# EAGLE design output (EAGLE 7.6.0)
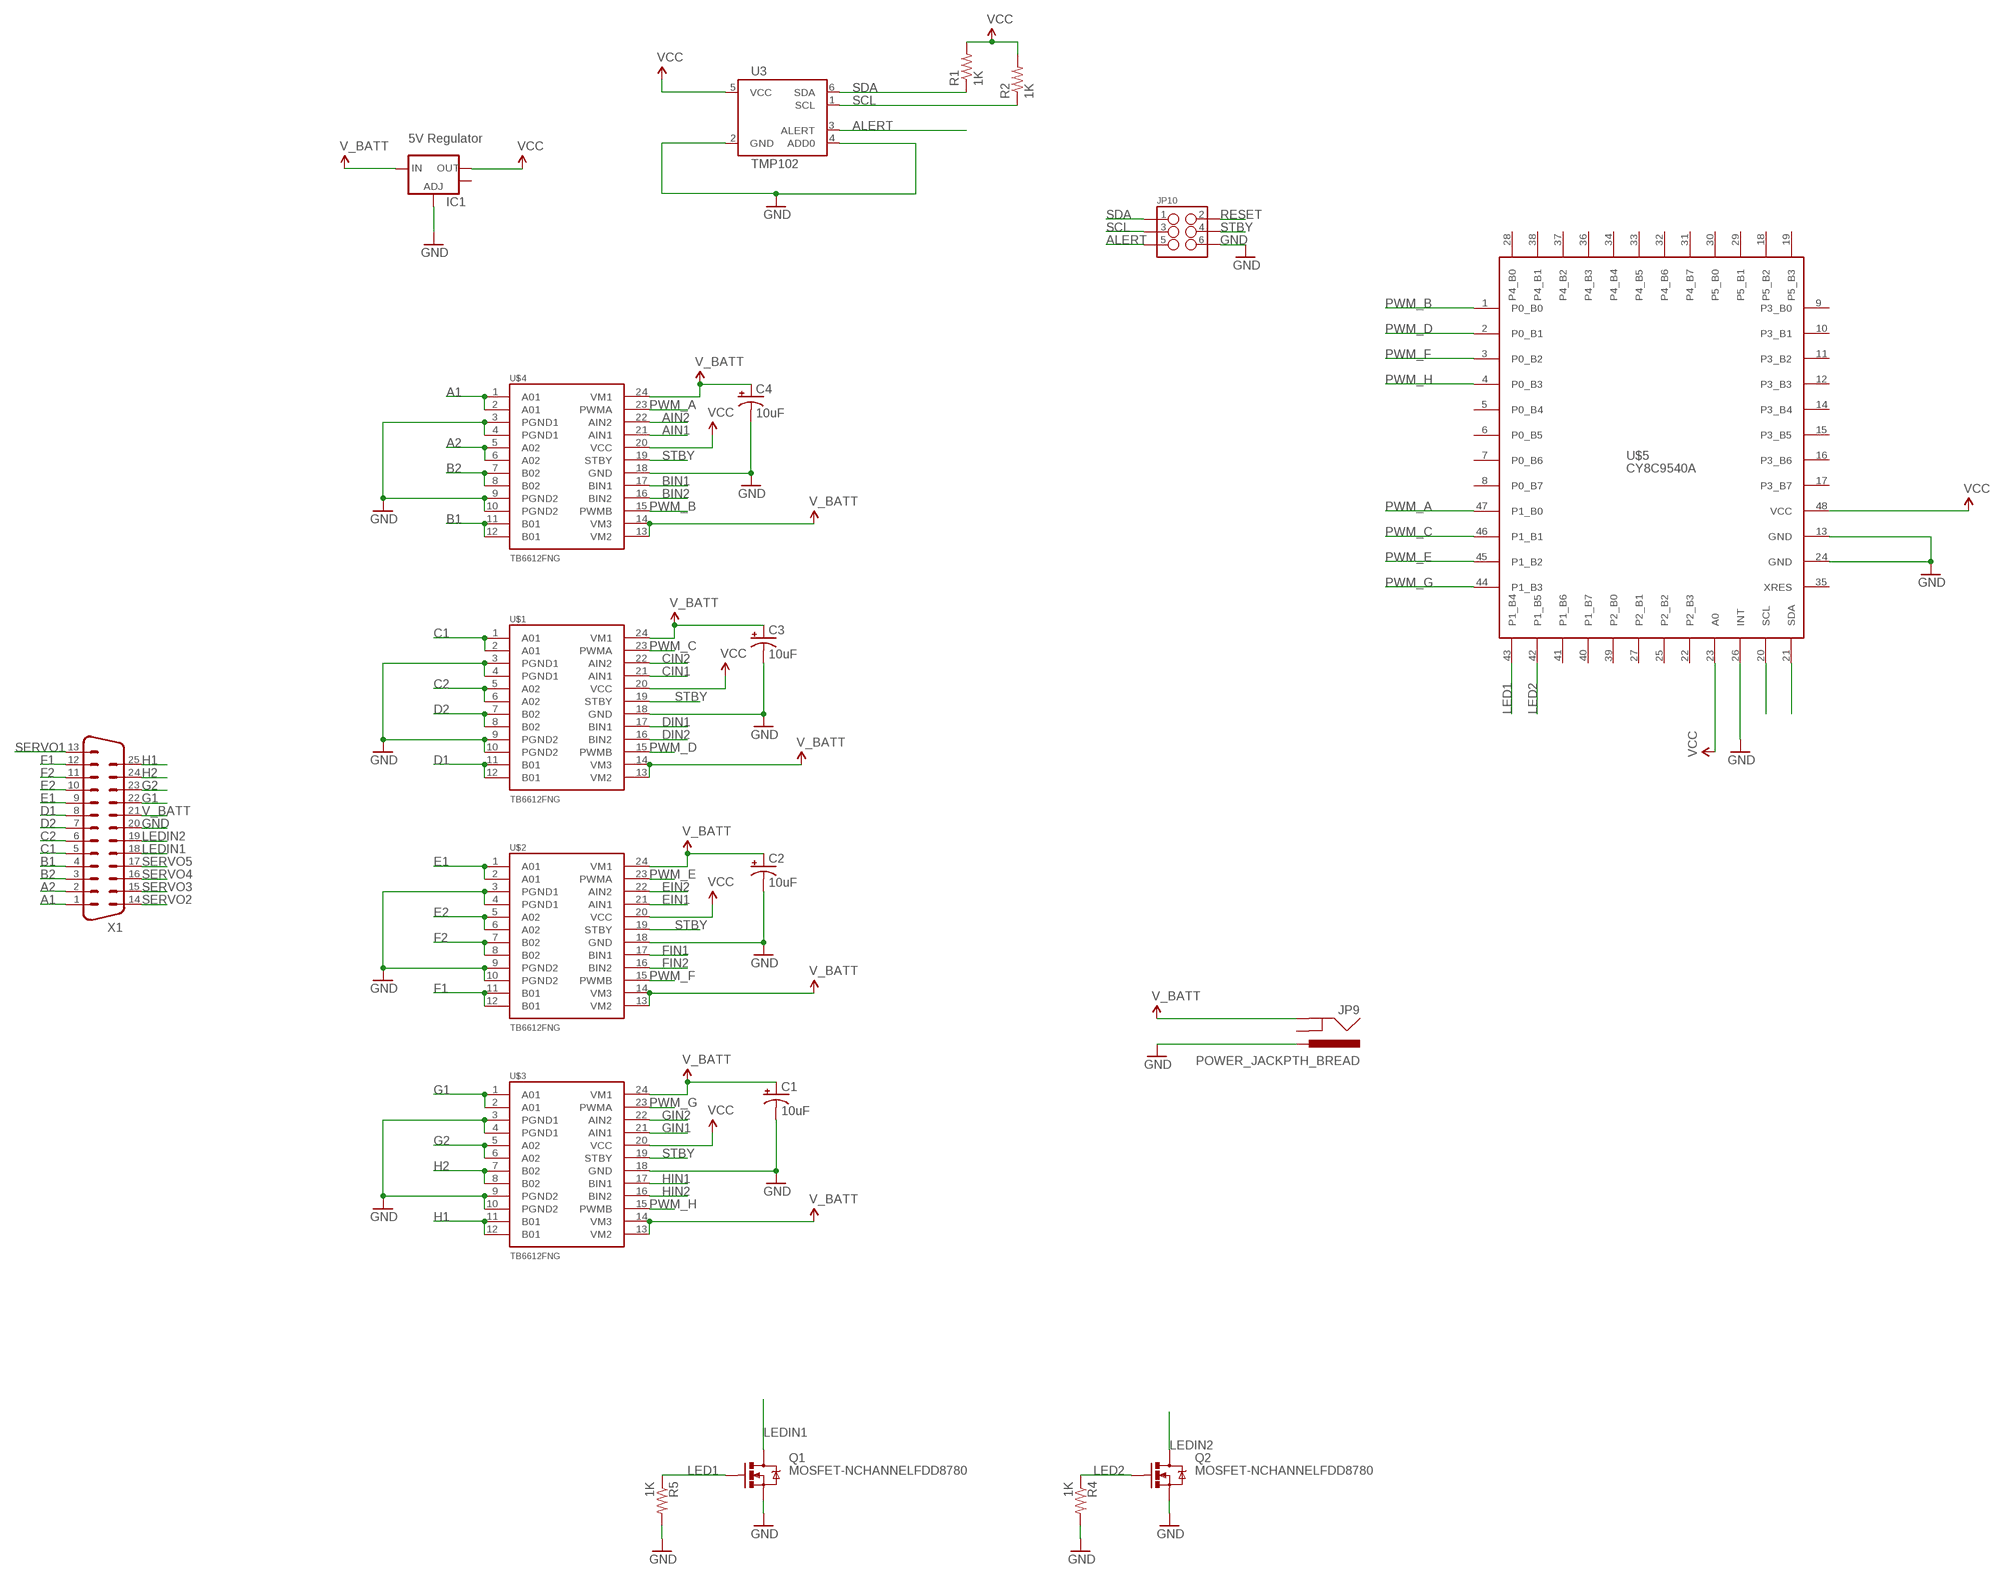
[diagram p0: schematic, sheet 1]

## Parts
C1  10uF  10UF-20V-10%(TANT)  [EIA3528]
C2  10uF  10UF-20V-10%(TANT)  [EIA3528]
C3  10uF  10UF-20V-10%(TANT)  [EIA3528]
C4  10uF  10UF-20V-10%(TANT)  [EIA3528]
IC1  V_REG_LM1117SOT223  [SOT223]
JP9  POWER_JACKPTH_BREAD  [POWER_JACK_PTH_BREAD]
JP10  M03X2SHROUD  [2X3-SHROUDED]
Q1  MOSFET-NCHANNELFDD8780  [DPAK]
Q2  MOSFET-NCHANNELFDD8780  [DPAK]
R1  1K  1KOHM-1/10W-1%(0603)  [0603-RES]
R2  1K  1KOHM-1/10W-1%(0603)  [0603-RES]
R4  1K  1KOHM-1/10W-1%(0603)  [0603-RES]
R5  1K  1KOHM-1/10W-1%(0603)  [0603-RES]
U3  TMP102  [SOT563]
U$1  TB6612FNG  [SSOP24]
U$2  TB6612FNG  [SSOP24]
U$3  TB6612FNG  [SSOP24]
U$4  TB6612FNG  [SSOP24]
U$5  CY8C9540A  [48-SSOP-CY]
X1  DB25D  [M25D]

## Nets
A1: U$4.1(A01) U$4.2(A01) X1.1
A2: U$4.5(A02) U$4.6(A02) X1.2
AIN1: U$4.21(AIN1)
AIN2: U$4.22(AIN2)
ALERT: JP10.5 U3.3(ALERT)
B1: U$4.11(B01) U$4.12(B01) X1.4
B2: U$4.7(B02) U$4.8(B02) X1.3
BIN1: U$4.17(BIN1)
BIN2: U$4.16(BIN2)
C1: U$1.1(A01) U$1.2(A01) X1.5
C2: U$1.5(A02) U$1.6(A02) X1.6
CIN1: U$1.21(AIN1)
CIN2: U$1.22(AIN2)
D1: U$1.11(B01) U$1.12(B01) X1.8
D2: U$1.7(B02) U$1.8(B02) X1.7
DIN1: U$1.17(BIN1)
DIN2: U$1.16(BIN2)
E1: U$2.1(A01) U$2.2(A01) X1.9
E2: U$2.5(A02) U$2.6(A02) X1.10
EIN1: U$2.21(AIN1)
EIN2: U$2.22(AIN2)
F1: U$2.11(B01) U$2.12(B01) X1.12
F2: U$2.7(B02) U$2.8(B02) X1.11
FIN1: U$2.17(BIN1)
FIN2: U$2.16(BIN2)
G1: U$3.1(A01) U$3.2(A01) X1.22
G2: U$3.5(A02) U$3.6(A02) X1.23
GIN1: U$3.21(AIN1)
GIN2: U$3.22(AIN2)
GND: C1.C(-) C2.C(-) C3.C(-) C4.C(-) IC1.1(ADJ) JP9.PWR JP10.6 Q1.3(S) Q2.3(S) R4.2 R5.2 U3.2(GND) U3.4(ADD0) U$1.3(PGND1) U$1.4(PGND1) U$1.9(PGND2) U$1.10(PGND2) U$1.18(GND) U$2.3(PGND1) U$2.4(PGND1) U$2.9(PGND2) U$2.10(PGND2) U$2.18(GND) U$3.3(PGND1) U$3.4(PGND1) U$3.9(PGND2) U$3.10(PGND2) U$3.18(GND) U$4.3(PGND1) U$4.4(PGND1) U$4.9(PGND2) U$4.10(PGND2) U$4.18(GND) U$5.13(GND) U$5.24(GND) U$5.26(INT) X1.20
H1: U$3.11(B01) U$3.12(B01) X1.25
H2: U$3.7(B02) U$3.8(B02) X1.24
HIN1: U$3.17(BIN1)
HIN2: U$3.16(BIN2)
LED1: Q1.1(G) R5.1 U$5.43(P1_B4)
LED2: Q2.1(G) R4.1 U$5.42(P1_B5)
LEDIN1: Q1.4(D) X1.18
LEDIN2: Q2.4(D) X1.19
PWM_A: U$4.23(PWMA) U$5.47(P1_B0)
PWM_B: U$4.15(PWMB) U$5.1(P0_B0)
PWM_C: U$1.23(PWMA) U$5.46(P1_B1)
PWM_D: U$1.15(PWMB) U$5.2(P0_B1)
PWM_E: U$2.23(PWMA) U$5.45(P1_B2)
PWM_F: U$2.15(PWMB) U$5.3(P0_B2)
PWM_G: U$3.23(PWMA) U$5.44(P1_B3)
PWM_H: U$3.15(PWMB) U$5.4(P0_B3)
RESET: JP10.2
SCL: JP10.3 R2.1 U3.1(SCL) U$5.20(SCL)
SDA: JP10.1 R1.1 U3.6(SDA) U$5.21(SDA)
SERVO1: X1.13
SERVO2: X1.14
SERVO3: X1.15
SERVO4: X1.16
SERVO5: X1.17
STBY: JP10.4 U$1.19(STBY) U$2.19(STBY) U$3.19(STBY) U$4.19(STBY)
V_BATT: C1.A(+) C2.A(+) C3.A(+) C4.A(+) IC1.3(IN) JP9.GND U$1.13(VM2) U$1.14(VM3) U$1.24(VM1) U$2.13(VM2) U$2.14(VM3) U$2.24(VM1) U$3.13(VM2) U$3.14(VM3) U$3.24(VM1) U$4.13(VM2) U$4.14(VM3) U$4.24(VM1) X1.21
VCC: IC1.2(OUT) R1.2 R2.2 U3.5(VCC) U$1.20(VCC) U$2.20(VCC) U$3.20(VCC) U$4.20(VCC) U$5.23(A0) U$5.48(VCC)
Unconnected: IC1.4(OUT) JP9.GNDBREAK U$5.5(P0_B4) U$5.6(P0_B5) U$5.7(P0_B6) U$5.8(P0_B7) U$5.9(P3_B0) U$5.10(P3_B1) U$5.11(P3_B2) U$5.12(P3_B3) U$5.14(P3_B4) U$5.15(P3_B5) U$5.16(P3_B6) U$5.17(P3_B7) U$5.18(P5_B2) U$5.19(P5_B3) U$5.22(P2_B3) U$5.25(P2_B2) U$5.27(P2_B1) U$5.28(P4_B0) U$5.29(P5_B1) U$5.30(P5_B0) U$5.31(P4_B7) U$5.32(P4_B6) U$5.33(P4_B5) U$5.34(P4_B4) U$5.35(XRES) U$5.36(P4_B3) U$5.37(P4_B2) U$5.38(P4_B1) U$5.39(P2_B0) U$5.40(P1_B7) U$5.41(P1_B6)

## Notes on the sheet
- 5V Regulator

## Library data of the parts
C1-C4 = SparkFun-Capacitors:10UF-20V-10%(TANT): CAP-08063; PROD_ID: CAP-08063
IC1 = SparkFun-PowerIC:V_REG_LM1117: Voltage Regulator LM1117 Standard adjustable voltage regulator but in SMD form. Spark Fun Electronics SKU : COM-00595; PROD_ID: VREG-08170
JP9 = SparkFun-Connectors:POWER_JACK: Power Jack This is the standard 5.5mm barrel jack for power. The PTH is the most common, proven, reliable, footprint. The Slot footprint only works if the mill layer is transmitted to the PCB fab house so be warned. Mating wall wart : TOL-00298 (and others); PROD_ID: PRT-10811
JP10 = SparkFun-Connectors:M03X2: 2x3 .1" header. Shrouded, with keying- CONN-10681 SMT- CONN-11415 Pogo pins- HW-11044; PROD_ID: CONN-10681
Q1 Q2 = SparkFun-DiscreteSemi:MOSFET-NCHANNEL: Common NMOSFET Parts MFG P/N Store ID Prod ID FDD8780 TRANS-09984 SI7820DN TRANS-11055 FDS6630A IC-08089 2N7002PW TRANS-11151 FQP30N06L COM-10213 TRANS-10060 BSS123LT1G TRANS-08345 BSS138 TRANS-00830 BS170 2N7000; PROD_ID: TRANS-09984
R1 R2 R4 R5 = SparkFun-Resistors:1KOHM-1/10W-1%(0603): RES-07856; PN: RC0603JR-071KL; PROD_ID: RES-07856
U3 = SparkFun-Sensors:TMP102: I2C degC temp sensor
U$1-U$4 = SparkFun-PowerIC:TB6612FNG: Toshiba 1A dual motor driver IC-09363; PROD_ID: IC-09363
U$5 = SpaceY:CY8C9540A
X1 = SparkFun-Connectors:DB25: Various DB25 connectors

## Board
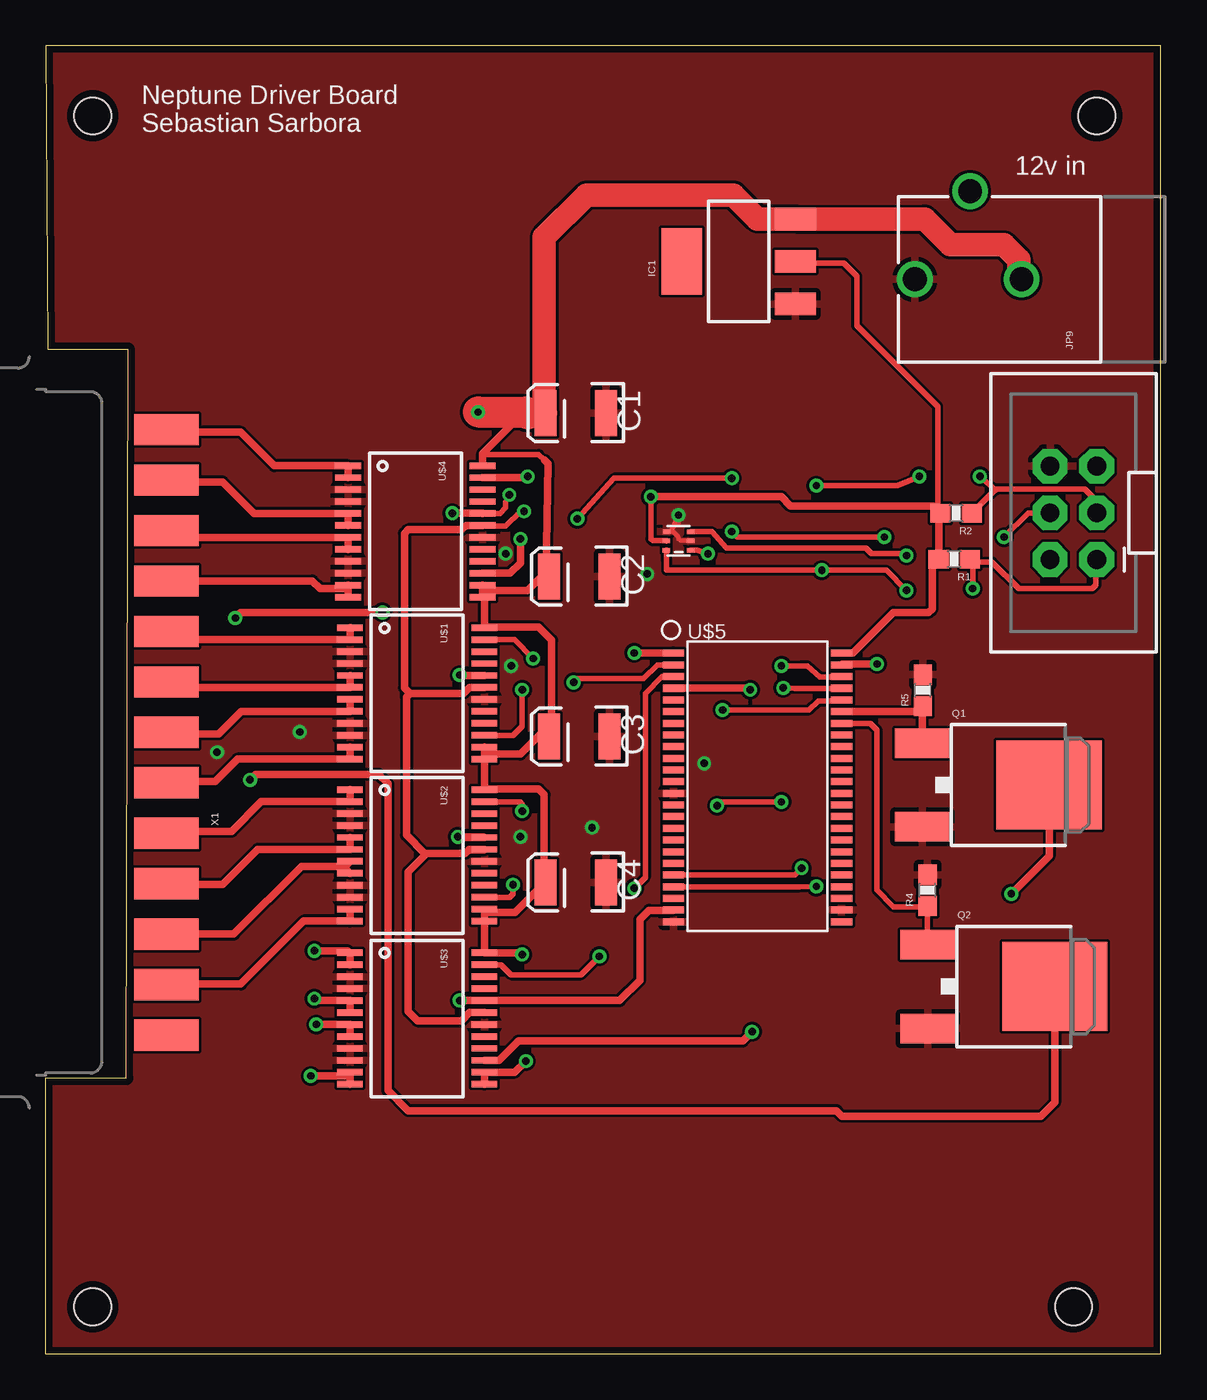
[diagram p1: board, top side]
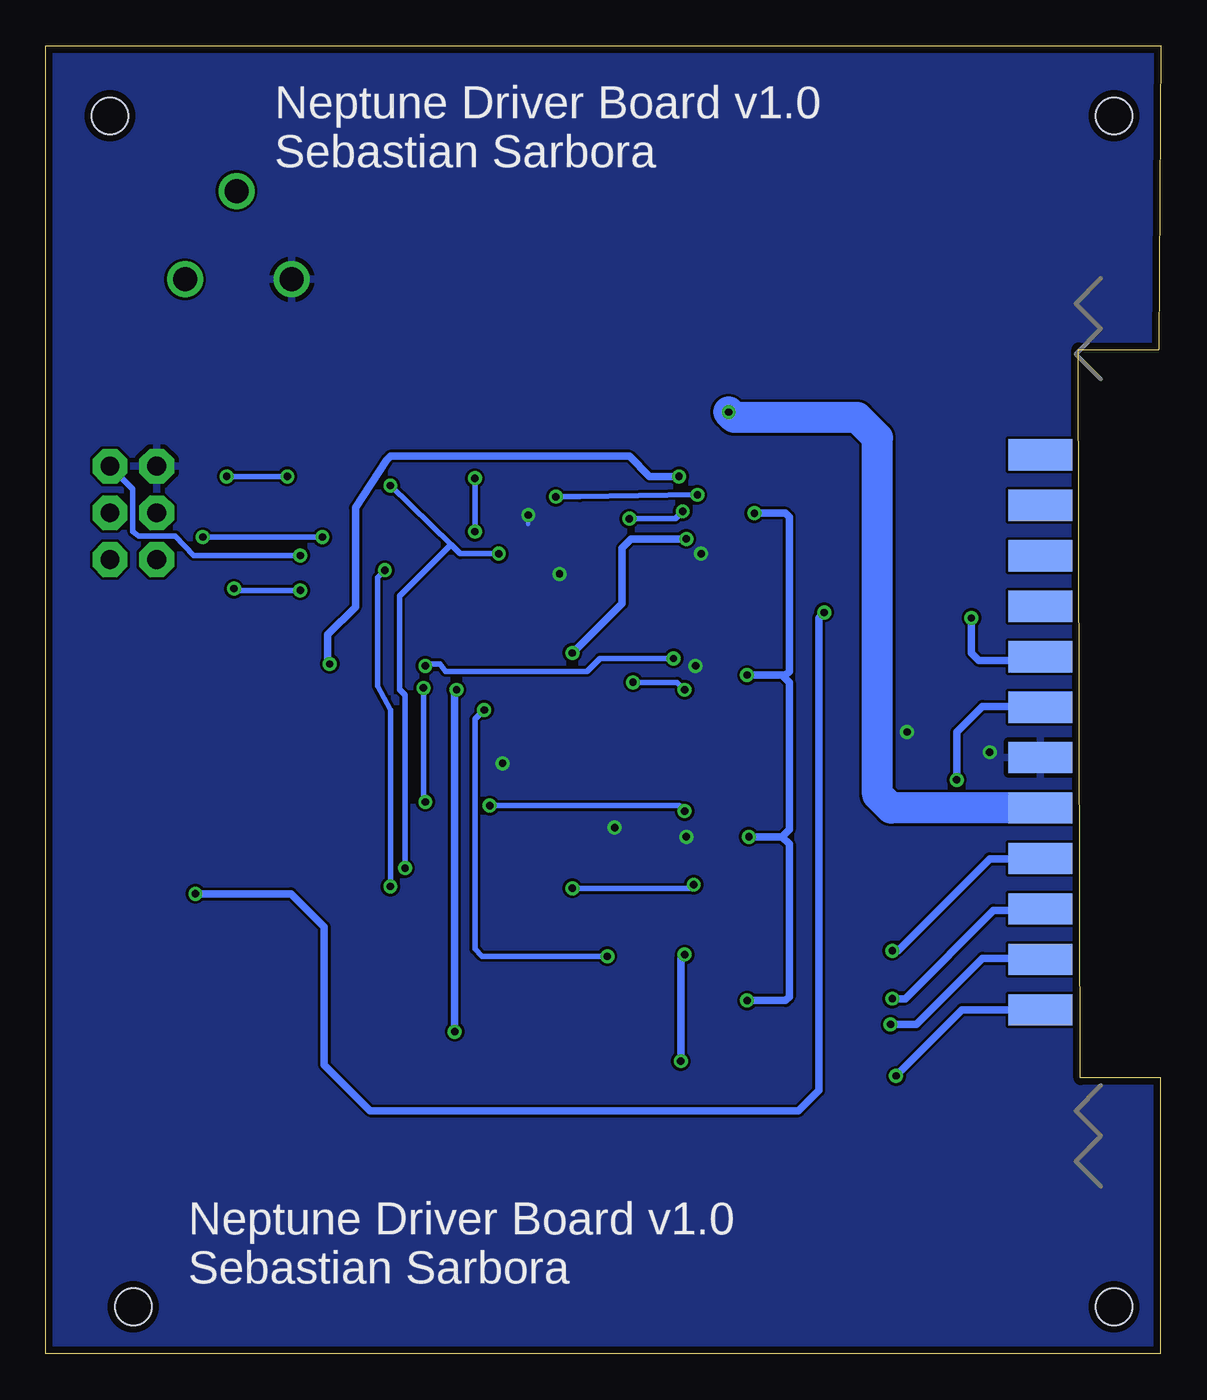
[diagram p2: board, bottom side, seen from below]

Size 60.63 x 71.11 mm. Coordinates in mm from the lower left corner, seen from the top.
Outline: 0,0 60.63,0 60.63,71.11 0,71.11 0.1,54.6 4.47,54.6 4.37,14.99 0,14.99 0,0
Copper layers (1*16): Top 0.0356mm / dielectric 1.5011mm / Bottom 0.0356mm
Design rules "oshpark-2layer": minimum track width 6mil, minimum drill 13mil, track to track 6mil, track to pad 6mil, pad to pad 6mil, via to via 6mil, smd to smd 6mil, copper to edge 15mil, drill to drill 6mil, minimum pad ring 7mil, minimum via ring 7mil, stop-mask expansion 4mil, vias tented up to drill 0mil, thermal gap 10mil
Holes 2 mm at 55.88,2.54 57.15,67.31 2.54,67.31 2.54,2.54

### Footprints (pad centres in the part's own frame; a part is rotated, then mirrored left to right if it is on the bottom)
EIA3528 = smd 1.2 x 2.5: A 1.65,0; C -1.65,0
SOT223 = smd 1.219 x 2.235: 1 -2.311,-3.099; 2 0,-3.099; 3 2.311,-3.099 | smd 3.6 x 2.2: 4 0,3.099
POWER_JACK_PTH_BREAD = drill 1.3: GND 0,7.9; GNDBREAK 4.8,10.7; PWR 0,13.7
2X3-SHROUDED = drill 1.016 pad 1.88 octagon: 1 -1.27,2.54; 2 1.27,2.54; 3 -1.27,0; 4 1.27,0; 5 -1.27,-2.54; 6 1.27,-2.54
DPAK = smd 1.6 x 3: 1 -2.28,-5.31; 3 2.28,-5.31 | smd 4.826 x 5.715: 4 0,1.588
0603-RES = smd 1.1 x 1: 1 -0.85,0; 2 0.85,0
SOT563 = smd 0.25 x 0.4: 1 -0.5,-0.66; 2 0,-0.66; 3 0.5,-0.66; 4 0.5,0.66; 5 0,0.66; 6 -0.5,0.67
SSOP24 = smd 0.348 x 1.397: 1 -3.575,-3.656; 2 -2.925,-3.656; 3 -2.275,-3.656; 4 -1.625,-3.656; 5 -0.975,-3.656; 6 -0.325,-3.656; 7 0.325,-3.656; 8 0.975,-3.656; 9 1.625,-3.656; 10 2.275,-3.656; 11 2.925,-3.656; 12 3.575,-3.656; 13 3.575,3.656; 14 2.925,3.656; 15 2.275,3.656; 16 1.625,3.656; 17 0.975,3.656; 18 0.325,3.656; 19 -0.325,3.656; 20 -0.975,3.656; 21 -1.625,3.656; 22 -2.275,3.656; 23 -2.925,3.656; 24 -3.575,3.656
48-SSOP-CY = smd 1.168 x 0.381: 1 -4.572,6.985; 2 -4.572,6.35; 3 -4.572,5.715; 4 -4.572,5.08; 5 -4.572,4.445; 6 -4.572,3.175; 7 -4.572,3.81; 8 -4.572,2.54; 9 -4.572,1.905; 10 -4.572,0.635; 11 -4.572,1.27; 12 -4.572,0; 13 -4.572,-0.635; 14 -4.572,-1.27; 15 -4.572,-1.905; 16 -4.572,-2.54; 17 -4.572,-3.175; 18 -4.572,-3.81; 19 -4.572,-4.445; 20 -4.572,-5.08; 21 -4.572,-5.715; 22 -4.572,-6.35; 23 -4.572,-6.985; 24 -4.572,-7.62; 25 4.572,-7.62; 26 4.572,-6.985; 27 4.572,-6.35; 28 4.572,-5.715; 29 4.572,-5.08; 30 4.572,-4.445; 31 4.572,-3.81; 32 4.572,-3.175; 33 4.572,-2.54; 34 4.572,-1.905; 35 4.572,-1.27; 36 4.572,-0.635; 37 4.572,0; 38 4.572,0.635; 39 4.572,1.27; 40 4.572,1.905; 41 4.572,2.54; 42 4.572,3.175; 43 4.572,3.81; 44 4.572,4.445; 45 4.572,5.08; 46 4.572,5.715; 47 4.572,6.35; 48 4.572,6.985
M25D = smd 1.7 x 3.5: 1 16.459,-6.045; 2 13.716,-6.045; 3 10.973,-6.045; 4 8.23,-6.045; 5 5.486,-6.045; 6 2.743,-6.045; 7 0,-6.045; 8 -2.743,-6.045; 9 -5.486,-6.045; 10 -8.23,-6.045; 11 -10.973,-6.045; 12 -13.716,-6.045; 13 -16.459,-6.045 | smd 1.7 x 3.5 bottom: 14 15.088,-6.045; 15 12.344,-6.045; 16 9.601,-6.045; 17 6.858,-6.045; 18 4.115,-6.045; 19 1.372,-6.045; 20 -1.372,-6.045; 21 -4.115,-6.045; 22 -6.858,-6.045; 23 -9.601,-6.045; 24 -12.344,-6.045; 25 -15.088,-6.045

### Placement (x,y rotation side)
C1  28.81,51.14 180 top
C2  29.01,42.25 180 top
C3  29.01,33.56 180 top
C4  28.81,25.63 180 top
IC1  37.67,59.39 90 top
JP9  60.96,58.42 90 top
JP10  55.88,45.72 180 top
Q1  52.97,30.92 270 top
Q2  53.27,19.96 270 top
R1  49.4,43.2 180 top
R2  49.5,45.7 180 top
R4  47.94,25.19 90 top
R5  47.69,36.07 90 top
U3  34.41,44.19 90 top
U$1  20.19,35.9 270 top
U$2  20.19,27.09 270 top
U$3  20.19,18.22 270 top
U$4  20.09,44.71 270 top
U$5  38.7,31.1 0 top
X1  0.51,33.78 90 top

### Tracks (layer width: path | path; a pad name or v marks a point on that pad's centre or on a via)
A1
  Top 0.406: U$4.2 U$4.1 12.41,48.28 10.6,50.1 6.69,50.1 X1.1
A2
  Top 0.406: U$4.6 U$4.5 11.31,45.69 9.6,47.4 6.65,47.4 X1.2
ALERT  (via drill 0.4)
  Top 0.305: U3.3 36.21,44.69 37,43.8 44.6,43.8 44.9,43.5 46.7,43.5 v46.8,43.4
  Bottom 0.305: v46.8,43.4 52.6,43.4 53.6,44.46 55.6,44.46 55.9,44.7 55.9,47.01 JP10.5
B1
  Top 0.406: X1.4 14.49,42.01 14.9,41.6 16.25,41.6 U$4.11 U$4.12
B2
  Top 0.406: U$4.8 U$4.7 6.92,44.38 X1.3
C1
  Top 0.406: U$1.1 U$1.2 7,38.83 X1.5
C2
  Top 0.406: U$1.5 U$1.6 6.85,36.23 X1.6
D1
  Top 0.406: U$1.11 U$1.12 10.43,32.33 9.2,31.1 6.61,31.1 X1.8
D2
  Top 0.406: U$1.7 U$1.8 10.62,34.92 9.4,33.7 6.63,33.7 X1.7
E1
  Top 0.406: U$2.1 U$2.2 11.71,30.02 10.1,28.4 6.66,28.4 X1.9
E2
  Top 0.406: U$2.5 U$2.6 11.52,27.41 9.6,25.5 6.61,25.5 X1.10
F1
  Top 0.406: U$2.11 U$2.12 14.02,23.52 10.6,20.1 6.59,20.1 X1.12
F2
  Top 0.406: X1.11 10.21,22.81 13.9,26.5 16.27,26.5 | 16.27,26.5 U$2.7 | 16.27,26.5 16.27,26.38 U$2.8
G1  (via drill 0.4)
  Top 0.406: U$3.2 U$3.1 16.41,21.8 16.4,21.8 16.4,21.9 v14.6,21.9
  Bottom 0.406: v14.6,21.9 14.3,21.9 9.3,26.9 6.58,26.9 X1.22
G2  (via drill 0.4)
  Top 0.406: U$3.6 U$3.5 14.71,19.2 v14.6,19.3
  Bottom 0.406: v14.6,19.3 13.9,19.3 9.1,24.1 6.63,24.1 X1.23
GND  (via drill 0.4)
  Top 0.254: 33.99,44.69 34.11,44.69 34.4,44.4 34.4,44.3 34.5,44.2 U3.2 | U3.4 33.99,44.69 | 33.99,44.69 v34.4,45.6 34.4,45.1
  Bottom 0.254: v34.4,45.6 34.4,45.1
  other vias: 25,43.5 25.3,37.4 35.8,32.1 25.8,28.1 29.7,28.6 9.3,32.7 13.8,33.8 32.7,42.4
  pour Bottom: 0.1,71.2 60.6,71.2 60.6,0 0.1,0
  pour Top: 0,71.1 60.6,71.1 60.6,0 0,0
H1  (via drill 0.4)
  Top 0.406: v14.4,15.1 16.34,15.1 U$3.11 U$3.12
  Bottom 0.406: X1.25 10.81,18.69 v14.4,15.1
H2  (via drill 0.4)
  Top 0.406: U$3.8 U$3.7 v14.71,17.89 v14.7,17.9
  Bottom 0.406: v14.7,17.9 13.3,17.9 9.7,21.5 6.62,21.5 X1.24
LED1
  Top 0.406: Q1.1 47.66,35.19 R5.1 47.38,34.91 U$5.43
LED2
  Top 0.305: U$5.42 44.83,34.27 45.2,33.9 45.2,25.2 46.1,24.3 47.9,24.3 R4.1 47.94,22.26 Q2.1
LEDIN1  (via drill 0.4)
  Top 0.406: Q1.4 54.56,27.06 v52.5,25 | v18.3,40.3 10.6,40.3 v10.3,40
  Bottom 0.406: v52.5,25 47.3,25 45.5,23.2 45.5,15.7 43,13.2 19.7,13.2 18.6,14.3 18.6,40 v18.3,40.3 | v10.3,40 10.3,38.1 9.9,37.7 6.75,37.7 X1.18
LEDIN2  (via drill 0.4)
  Top 0.406: Q2.4 54.86,13.66 54.1,12.9 43.3,12.9 43,13.2 19.7,13.2 18.6,14.3 18.6,31 18.1,31.5 11.4,31.5 v11.1,31.2
  Bottom 0.406: v11.1,31.2 11.1,33.8 9.7,35.2 6.6,35.2 X1.19
PWM_A  (via drill 0.4)
  Top 0.406: U$4.23 26.07,47.63 v26.2,47.7 | v45.2,37.5 43.32,37.5 U$5.47
  Bottom 0.406: v45.2,37.5 45.3,37.6 45.3,39.1 43.8,40.6 43.8,46 42.1,48.6 41.9,48.8 28.9,48.8 27.8,47.7 v26.2,47.7
PWM_B  (via drill 0.4)
  Top 0.406: U$4.15 25.23,42.44 25.8,43 v25.8,44.3 | v32,38.1 34.11,38.1 U$5.1
  Bottom 0.406: v25.8,44.3 28.8,44.3 29.3,43.8 29.3,40.8 v32,38.1
PWM_C  (via drill 0.4)
  Top 0.305: U$1.23 25.48,38.83 v26.5,37.8 | v40,37.4 41.1,37.4 41.4,37.4 42.1,36.8 43.26,36.8 U$5.46
  Bottom 0.305: v26.5,37.8 30.5,37.8 31.2,37.1 38.9,37.1 39.2,37.5 39.9,37.5 v40,37.4
PWM_D  (via drill 0.4)
  Top 0.305: U$5.2 33.25,37.45 32.5,36.7 28.9,36.7 v28.7,36.5 | v25.9,36.1 25.9,34.1 25.4,33.6 23.87,33.6 U$1.15
  Bottom 0.305: v28.7,36.5 26.3,36.5 v25.9,36.1
PWM_E  (via drill 0.4)
  Top 0.305: U$5.45 40.72,36.18 v40.1,36.2 | v40,30 36.6,30 v36.5,29.8 | v25.9,29.5 25.9,29.9 25.8,30 23.86,30 U$2.23
  Bottom 0.305: v40.1,36.2 40.1,30 v40,30 | v36.5,29.8 26.2,29.8 v25.9,29.5
PWM_F  (via drill 0.4)
  Top 0.305: U$5.3 33.52,36.81 32.6,35.9 32.6,25.9 v32,25.3 | v25.4,25.5 25.4,25 25.2,24.8 23.86,24.8 U$2.15
  Bottom 0.305: v32,25.3 25.6,25.3 v25.4,25.5
PWM_G  (via drill 0.4)
  Top 0.305: U$3.23 24.75,21.14 25.3,20.6 29.1,20.6 v30.1,21.6 | v36.8,35 41.5,35 42,35.5 43.23,35.5 U$5.44
  Bottom 0.305: v30.1,21.6 36.9,21.6 37.3,22 37.3,34.5 v36.8,35
PWM_H  (via drill 0.4)
  Top 0.406: U$3.15 24.64,15.95 25.7,17 37.9,17 v38.4,17.5 | v38.3,36.1 38.2,36.2 34.15,36.2 U$5.4
  Bottom 0.406: v38.4,17.5 38.4,36 v38.3,36.1
SCL  (via drill 0.4)
  Top 0.305: JP10.3 57.15,46.35 56.5,47 51.65,47 | 51.65,47 R2.1 | U3.1 35.41,43.69 v36,43.5 | v41.9,47.2 46.3,47.2 v47.5,47.7 | 51.65,47 51.65,46.95 v50.8,47.7 | U$5.20 40.72,26.02 v41.1,26.4
  Bottom 0.305: v36,43.5 38.1,43.5 38.6,44 | 38.6,44 v41.9,47.2 | v47.5,47.7 v50.8,47.7 | v41.1,26.4 41.1,35.8 41.4,36.1 41.4,41.2 38.6,44
SDA  (via drill 0.4)
  Top 0.305: U3.6 33.74,43.16 33.75,42.6 v42.2,42.6 45.7,42.6 v46.8,41.5 | v50.4,41.6 50.4,43.05 | 50.4,43.05 R1.1 | 50.4,43.05 51.45,43.05 52.9,41.6 56.9,41.6 57.1,41.8 57.1,43.13 JP10.1 | U$5.21 40.98,25.39 v41.9,25.4
  Bottom 0.305: v46.8,41.5 50.3,41.5 v50.4,41.6 | v41.9,25.4 41.9,35 42.6,36.3 42.6,42.2 v42.2,42.6
STBY  (via drill 0.4)
  Top 0.305: JP10.4 53.42,45.72 v52.1,44.4 | v45.6,44.4 37.6,44.4 v37.3,44.7 | v37.3,47.6 30.9,47.6 v28.9,45.4 | v26,45.8 25.8,45.8 25,45 23.78,45 U$4.19
  Top 0.406: U$3.19 23.05,18.55 22.6,18.1 20.2,18.1 19.7,18.6 19.7,26.2 20.7,27.2 | U$1.19 23.02,36.23 22.7,35.9 19.8,35.9 | 19.8,35.9 19.6,35.7 19.6,28.2 20.6,27.2 20.7,27.2 | 23,27.4 22.8,27.2 20.7,27.2 | 23,27.4 23.83,27.4 U$2.19 23.02,27.41 23,27.4 | U$4.19 22.84,45.03 22.6,44.8 19.7,44.8 19.5,44.6 19.5,36.2 19.8,35.9
  Bottom 0.305: v52.1,44.4 v45.6,44.4 | v37.3,44.7 v37.3,47.6 | v28.9,45.4 26.4,45.4 v26,45.8
V_BATT  (via drill 0.4)
  Top 0.305: U$4.24 23.75,48.85 23.8,48.9 26.8,48.9 27.11,48.59
  Top 0.406: U$3.13 U$3.14 25.5,15.29 v26.1,15.9 | U$1.13 U$1.14 23.85,32.65 23.9,32.6 24.12,32.6 | U$4.14 U$4.13 | C3.A 26.76,33.56 | 26.76,33.56 25.8,32.6 24.12,32.6 | 24.12,32.6 U$1.13 | U$4.13 23.85,41.03 U$1.24 23.87,39.5 26.8,39.5 27.5,38.8 27.5,34.3 26.76,33.56 | U$4.13 24.11,41.5 26.2,41.5 26.95,42.25 C2.A 27.2,42.41 27.3,48.4 27.11,48.59 | U$4.24 23.75,48.95 25.9,51.1 26.2,51.1 27.12,51.1 C1.A | v25.9,21.7 25.8,21.8 U$3.24 U$2.13 U$2.14 24.01,24 25.5,24 27.13,25.63 C4.A 27.1,25.69 27.1,30.4 26.8,30.7 23.88,30.7 U$2.24 U$1.13
  Top 1.27: JP9.GND 52.9,58.58 52.9,59.5 52.1,60.3 49.2,60.3 47.8,61.7 IC1.3 38.7,61.7 37.4,63 29.4,63 27.1,60.7 27.1,51.2 C1.A
  Top 1.676: v23.5,51.2 26.1,51.2 26.2,51.1
  Bottom 0.406: v26.1,15.9 26.1,21.5 v25.9,21.7
  Bottom 1.676: X1.21 14.67,29.67 15.4,30.4 15.4,49.8 16.5,50.9 23.2,50.9 v23.5,51.2
VCC  (via drill 0.4)
  Top 0.305: R2.2 48.4,45.7 48.5,45.6 48.5,51.5 44.1,55.9 44.1,58.6 43.4,59.3 40.86,59.3 IC1.2 | v32.9,46.6 32.9,44.3 33,44.2 U3.5 | U$4.20 24.68,45.69 25,46 25,46.3 v25.2,46.7
  Top 0.406: v22.5,19.2 U$3.20 31.2,19.2 32.3,20.3 32.3,23.6 32.8,24.1 34.11,24.1 U$5.23 | U$1.20 22.52,36.88 v22.5,36.9 | v22.1,45.7 23.73,45.7 U$4.20 | U$5.48 43.88,38.09 46.1,40.3 48,40.3 48.2,40.5 48.2,42.85 R1.2 48.55,45.6 R2.2 48.25,46.1 40.5,46.1 40,46.6 v32.9,46.6 | v22.4,28.1 23.81,28.1 U$2.20 22.43,28.07 v22.4,28.1
  Bottom 0.305: v25.2,46.7 31.6,46.6 v32.9,46.6
  Bottom 0.406: 20.6,28.1 20.2,28.5 20.2,36.5 20.6,36.9 v22.5,36.9 20.4,36.9 20.2,37.1 20.2,45.5 20.4,45.7 v22.1,45.7 | v22.4,28.1 20.6,28.1 | 20.6,28.1 20.2,27.7 20.2,19.4 20.4,19.2 v22.5,19.2

### Text on the board
tPlace: Neptune Driver Board / Sebastian Sarbora | 12v in
bPlace: Neptune Driver Board v1.0 / Sebastian Sarbora | Neptune Driver Board v1.0 / Sebastian Sarbora